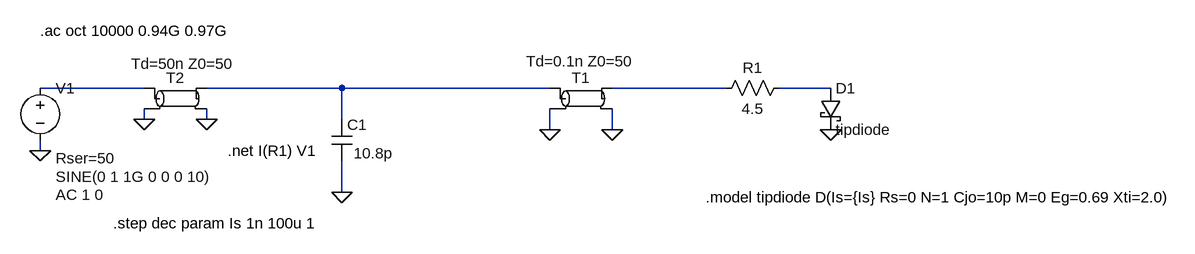
[diagram p0: schematic MIMSchottky.asc]
MIMSchottky.asc, the LTspice schematic file:
Version 4
SHEET 1 1848 680
WIRE -208 80 -368 80
WIRE 96 80 -112 80
WIRE 416 80 96 80
WIRE 688 80 512 80
WIRE 848 80 768 80
WIRE -208 128 -208 112
WIRE -112 128 -112 112
WIRE 96 128 96 80
WIRE 416 144 416 112
WIRE 512 144 512 112
WIRE -368 176 -368 160
WIRE 96 240 96 192
FLAG -112 128 0
FLAG -368 176 0
FLAG -208 128 0
FLAG 416 144 0
FLAG 512 144 0
FLAG 96 240 0
FLAG 848 144 0
SYMBOL voltage -368 64 R0
WINDOW 3 24 152 Left 2
WINDOW 123 24 180 Left 2
WINDOW 39 24 124 Left 2
SYMATTR Value SINE(0 1 1G 0 0 0 10)
SYMATTR Value2 AC 1 0
SYMATTR SpiceLine Rser=50
SYMATTR InstName V1
SYMBOL tline -160 96 R0
WINDOW 3 12 -69 Top 2
SYMATTR InstName T2
SYMBOL cap 80 128 R0
WINDOW 3 34 52 Left 2
SYMATTR Value 10.8p
SYMATTR InstName C1
SYMBOL tline 464 96 R0
WINDOW 3 -1 -73 Top 2
SYMATTR Value Td=0.1n Z0=50
SYMATTR InstName T1
SYMBOL res 784 64 R90
WINDOW 0 0 56 VBottom 2
WINDOW 3 32 56 VTop 2
SYMATTR InstName R1
SYMATTR Value 4.5
SYMBOL schottky 832 80 R0
SYMATTR InstName D1
SYMATTR Value tipdiode
SYMATTR Description Diode
SYMATTR Type diode
TEXT -368 -8 Left 2 !.ac oct 10000 0.94G 0.97G
TEXT -80 176 Left 2 !.net I(R1) V1
TEXT -256 288 Left 2 !.step dec param Is 1n 100u 1
TEXT 656 248 Left 2 !.model tipdiode D(Is={Is} Rs=0 N=1 Cjo=10p M=0 Eg=0.69 Xti=2.0)

The netlist it stands for:
* MIMSchottky.asc
V1 N001 0 SINE(0 1 1G 0 0 0 10) AC 1 0 Rser=50
T2 N001 0 N002 0 Td=50n Z0=50
C1 N002 0 10.8p
T1 N002 0 N003 0 Td=0.1n Z0=50
R1 N004 N003 4.5
D1 N004 0 tipdiode
.model D D
.lib standard.dio
.ac oct 10000 0.94G 0.97G
.net I(R1) V1
.step dec param Is 1n 100u 1
.model tipdiode D(Is={Is} Rs=0 N=1 Cjo=10p M=0 Eg=0.69 Xti=2.0)
.backanno
.end